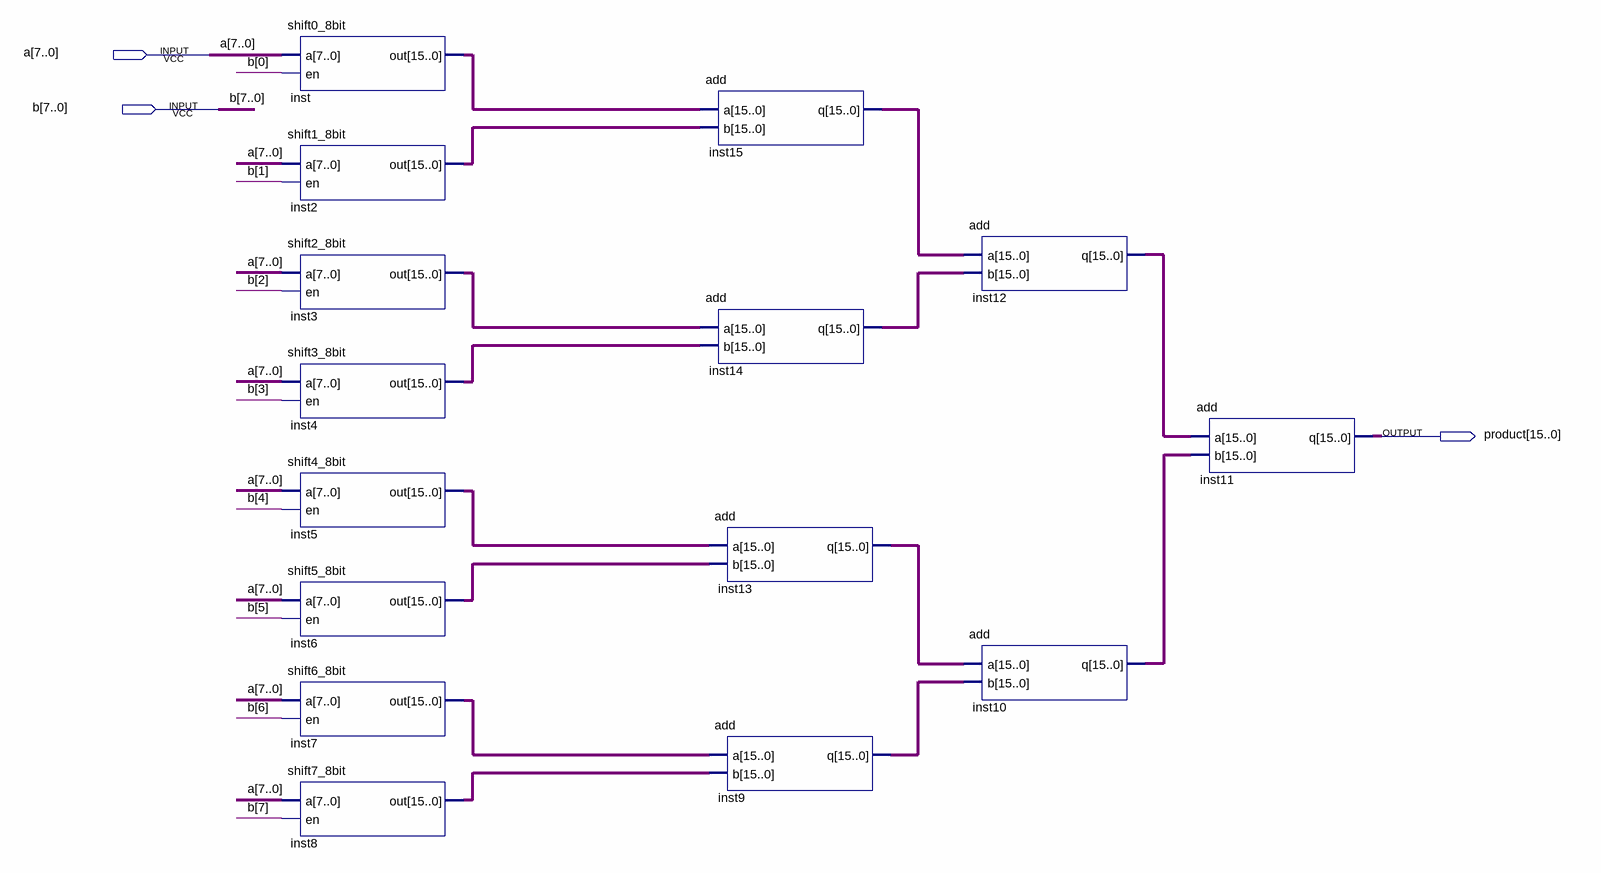
[diagram p0: schematic sheet]
// Quartus schematic multiplier_8bit.bdf as structural Verilog: 15 symbols, 3 pins
module multiplier_8bit (
  input  [7:0] a,
  input  [7:0] b,
  output [15:0] product
);

  wire [15:0] inst2_out, inst3_out, inst4_out, inst5_out, inst6_out, inst7_out, inst8_out, inst9_q, inst10_q,
       inst12_q, inst13_q, inst14_q, inst15_q, inst_out;

  shift0_8bit inst (.a(a), .en(b[0]), .out(inst_out));
  shift1_8bit inst2 (.a(a), .en(b[1]), .out(inst2_out));
  shift2_8bit inst3 (.a(a), .en(b[2]), .out(inst3_out));
  shift3_8bit inst4 (.a(a), .en(b[3]), .out(inst4_out));
  shift4_8bit inst5 (.a(a), .en(b[4]), .out(inst5_out));
  shift5_8bit inst6 (.a(a), .en(b[5]), .out(inst6_out));
  shift6_8bit inst7 (.a(a), .en(b[6]), .out(inst7_out));
  shift7_8bit inst8 (.a(a), .en(b[7]), .out(inst8_out));
  add inst15 (.a(inst_out), .b(inst2_out), .q(inst15_q));
  add inst14 (.a(inst3_out), .b(inst4_out), .q(inst14_q));
  add inst13 (.a(inst5_out), .b(inst6_out), .q(inst13_q));
  add inst9 (.a(inst7_out), .b(inst8_out), .q(inst9_q));
  add inst12 (.a(inst15_q), .b(inst14_q), .q(inst12_q));
  add inst10 (.a(inst13_q), .b(inst9_q), .q(inst10_q));
  add inst11 (.a(inst12_q), .b(inst10_q), .q(product));
endmodule
